# EAGLE design B12356-04 (EAGLE 6.6.0)
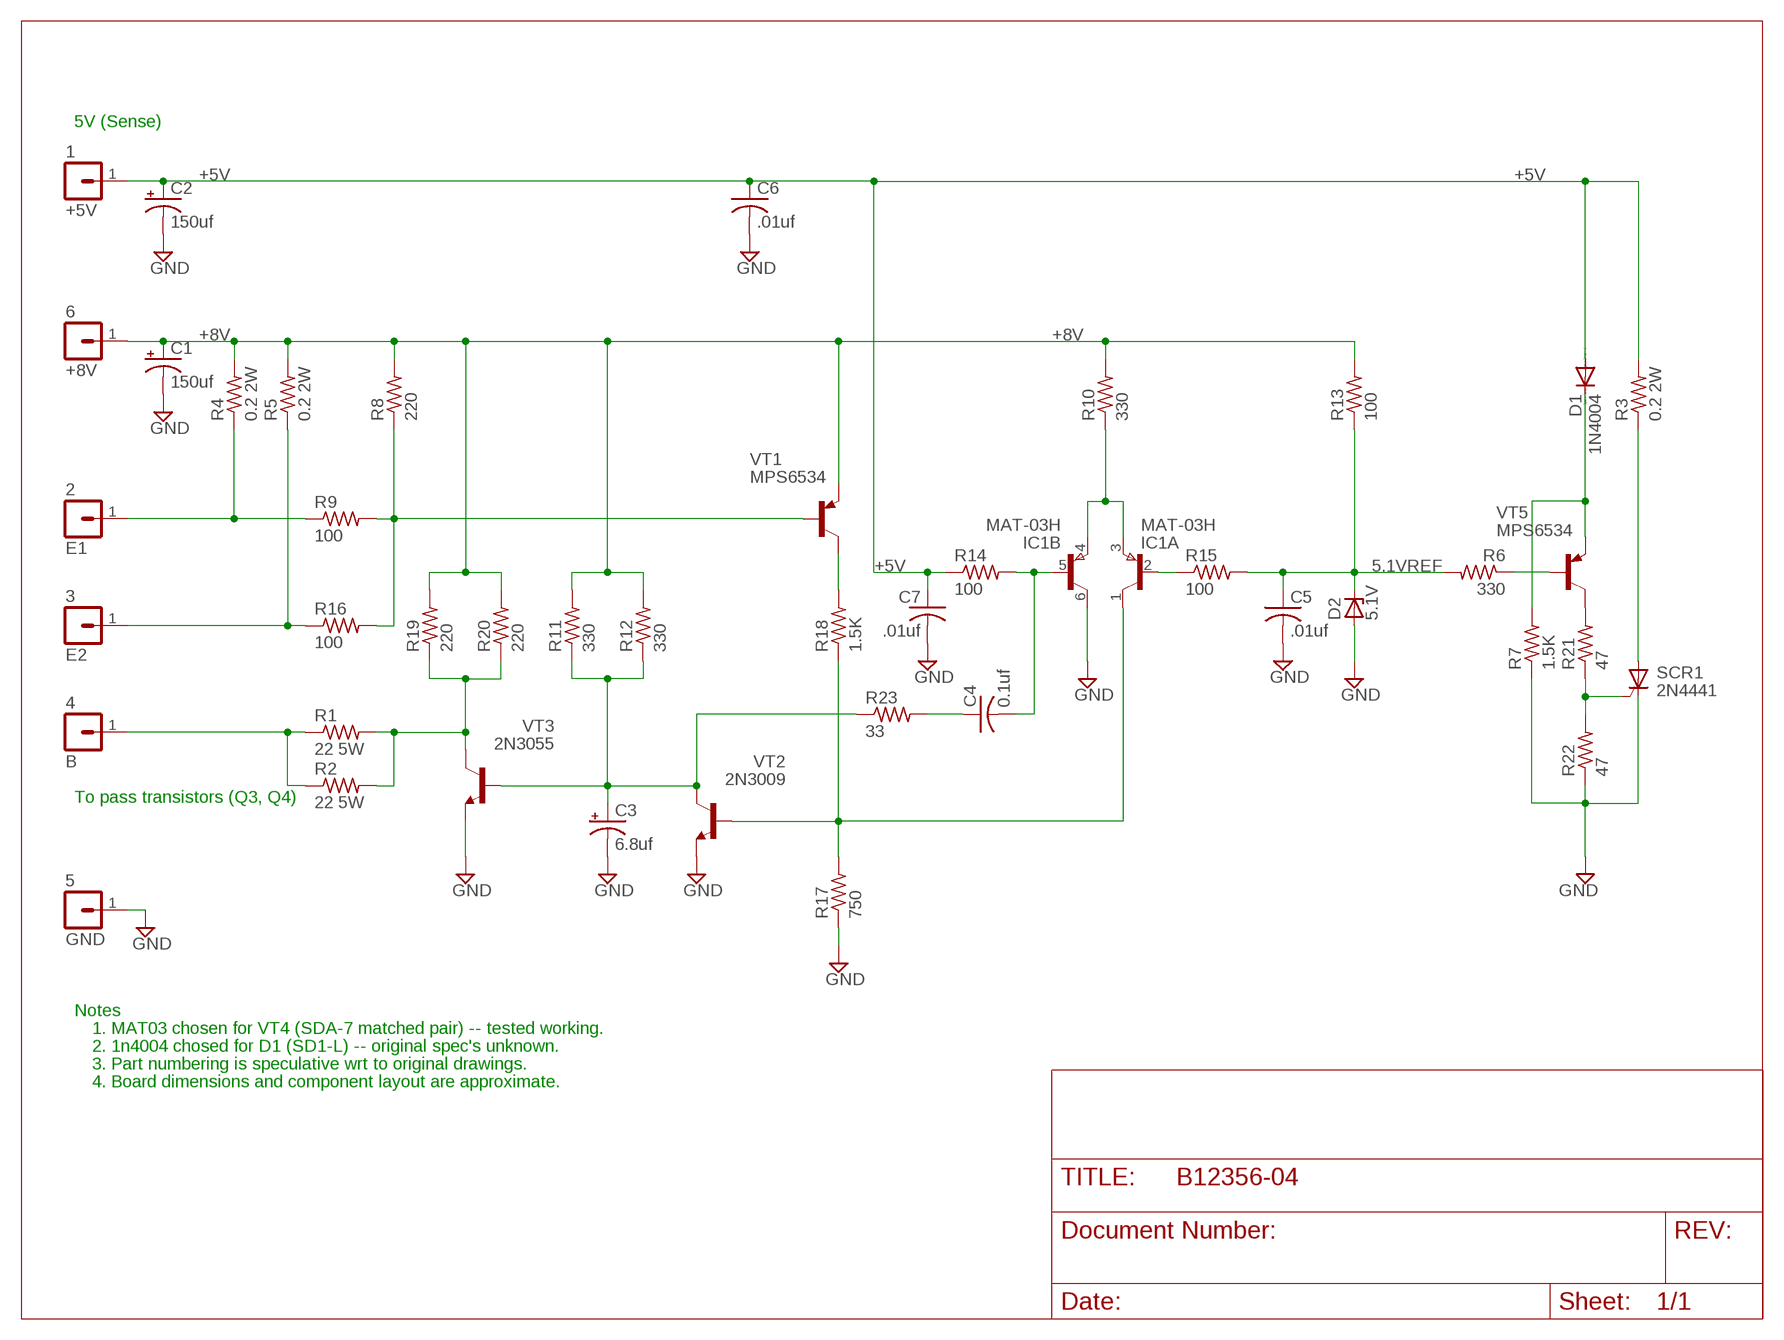
[diagram p0: schematic, sheet 1]

## Parts
+5V  1  LUG  [SPADELUG]
+8V  6  LUG  [SPADELUG]
B  4  LUG  [SPADELUG]
C1  150uf  CPOL-USE22-6AXIAL  [E22-6]
C2  150uf  CPOL-USE22-6AXIAL  [E22-6]
C3  6.8uf  CPOL-USE15-5AXIAL  [E15-5]
C4  0.1uf  C-US102-064X133  [C102-064X133]
C5  .01uf  C-US050-025X075  [C050-025X075]
C6  .01uf  C-US050-025X075  [C050-025X075]
C7  .01uf  C-US050-025X075  [C050-025X075]
D1  1N4004  [DO41-10]
D2  5.1V  ZENER-DIODEDO41Z10  [DO41Z10]
E1  2  LUG  [SPADELUG]
E2  3  LUG  [SPADELUG]
GND  5  LUG  [SPADELUG]
IC1  MAT-03H  [TO78]
R1  22 5W  R-US_0817/22  [P0817/22]
R2  22 5W  R-US_0817/22  [P0817/22]
R3  0.2 2W  R-US_0414/15  [0414/15]
R4  0.2 2W  R-US_0414/15  [0414/15]
R5  0.2 2W  R-US_0414/15  [0414/15]
R6  330  R-US_0207/10  [0207/10]
R7  1.5K  R-US_0207/10  [0207/10]
R8  220  R-US_0207/10  [0207/10]
R9  100  R-US_0207/10  [0207/10]
R10  330  R-US_0207/10  [0207/10]
R11  330  R-US_0207/10  [0207/10]
R12  330  R-US_0207/10  [0207/10]
R13  100  R-US_0207/10  [0207/10]
R14  100  R-US_0207/10  [0207/10]
R15  100  R-US_0207/10  [0207/10]
R16  100  R-US_0207/10  [0207/10]
R17  750  R-US_0207/10  [0207/10]
R18  1.5K  R-US_0207/10  [0207/10]
R19  220  R-US_0207/10  [0207/10]
R20  220  R-US_0207/10  [0207/10]
R21  47  R-US_0207/10  [0207/10]
R22  47  R-US_0207/10  [0207/10]
R23  33  R-US_0207/10  [0207/10]
SCR1  2N4441  BT151  [TO220CL]
VT1  MPS6534  MPSA56-PNP-TO92-BCE  [TO92-BCE]
VT2  2N3009  2N2222  [TO18]
VT3  2N3055  [TO3]
VT5  MPS6534  MPSA56-PNP-TO92-BCE  [TO92-BCE]

## Nets
5.1VREF: C5.1 D2.C R6.2 R13.1 R15.2
+5V: +5V.1 C2.+ C6.1 C7.1 D1.A R3.2 R14.1
+8V: +8V.1 C1.+ R4.2 R5.2 R8.2 R10.2 R11.2 R12.2 R13.2 R19.2 R20.2 VT1.E
GND: C1.- C2.- C3.- C5.2 C6.2 C7.2 D2.A GND.1 IC1.6(B:C) R7.1 R17.1 R22.1 SCR1.C VT2.1(E) VT3.E
N$1: IC1.2(A:B) R15.1
N$2: IC1.3(A:E) IC1.4(B:E) R10.1
N$3: R3.1 SCR1.A
N$4: R21.1 R22.2 SCR1.G
N$5: E1.1 R4.1 R9.1
N$6: E2.1 R5.1 R16.1
N$7: R8.1 R9.2 R16.2 VT1.B
N$8: R21.2 VT5.C
N$9: D1.C R7.2 VT5.E
N$10: R6.1 VT5.B
N$11: IC1.1(A:C) R17.2 R18.1 VT2.2(B)
N$12: B.1 R1.1 R2.1
N$13: R18.2 VT1.C
N$14: C3.+ R11.1 R12.1 R23.1 VT2.3(C) VT3.B
N$16: R1.2 R2.2 R19.1 R20.1 VT3.C VT3.C/(C)
N$18: C4.2 IC1.5(B:B) R14.2
N$19: C4.1 R23.2

## Notes on the sheet
- 5V (Sense)
- To pass transistors (Q3, Q4)
- Notes
- 1. MAT03 chosen for VT4 (SDA-7 matched pair) -- tested working.
- 2. 1n4004 chosed for D1 (SD1-L) -- original spec's unknown.
- 3. Part numbering is speculative wrt to original drawings.
- 4. Board dimensions and component layout are approximate.

## Library data of the parts
+5V +8V B E1 E2 GND = dec-con:LUG: Spade Lug
C1-C3 = rcl:CPOL-US: POLARIZED CAPACITOR, American symbol
C4-C7 = rcl:C-US: CAPACITOR, American symbol
D1 = diode:1N4004: DIODE general purpose rectifier, 1 A
D2 = diode:ZENER-DIODE: Z-Diode
IC1 = linear:MAT-03H: Dual TRANSISTOR
R1-R23 = rcl:R-US_: RESISTOR, American symbol
SCR1 = triac:BT151: THYRISTOR
VT1 VT5 = transistor:*-PNP-: PNP Transistror
VT2 = transistor:2N2222: NPN TRANSISTOR
VT3 = transistor-npn:2N3055: NPN Transistor

## Board
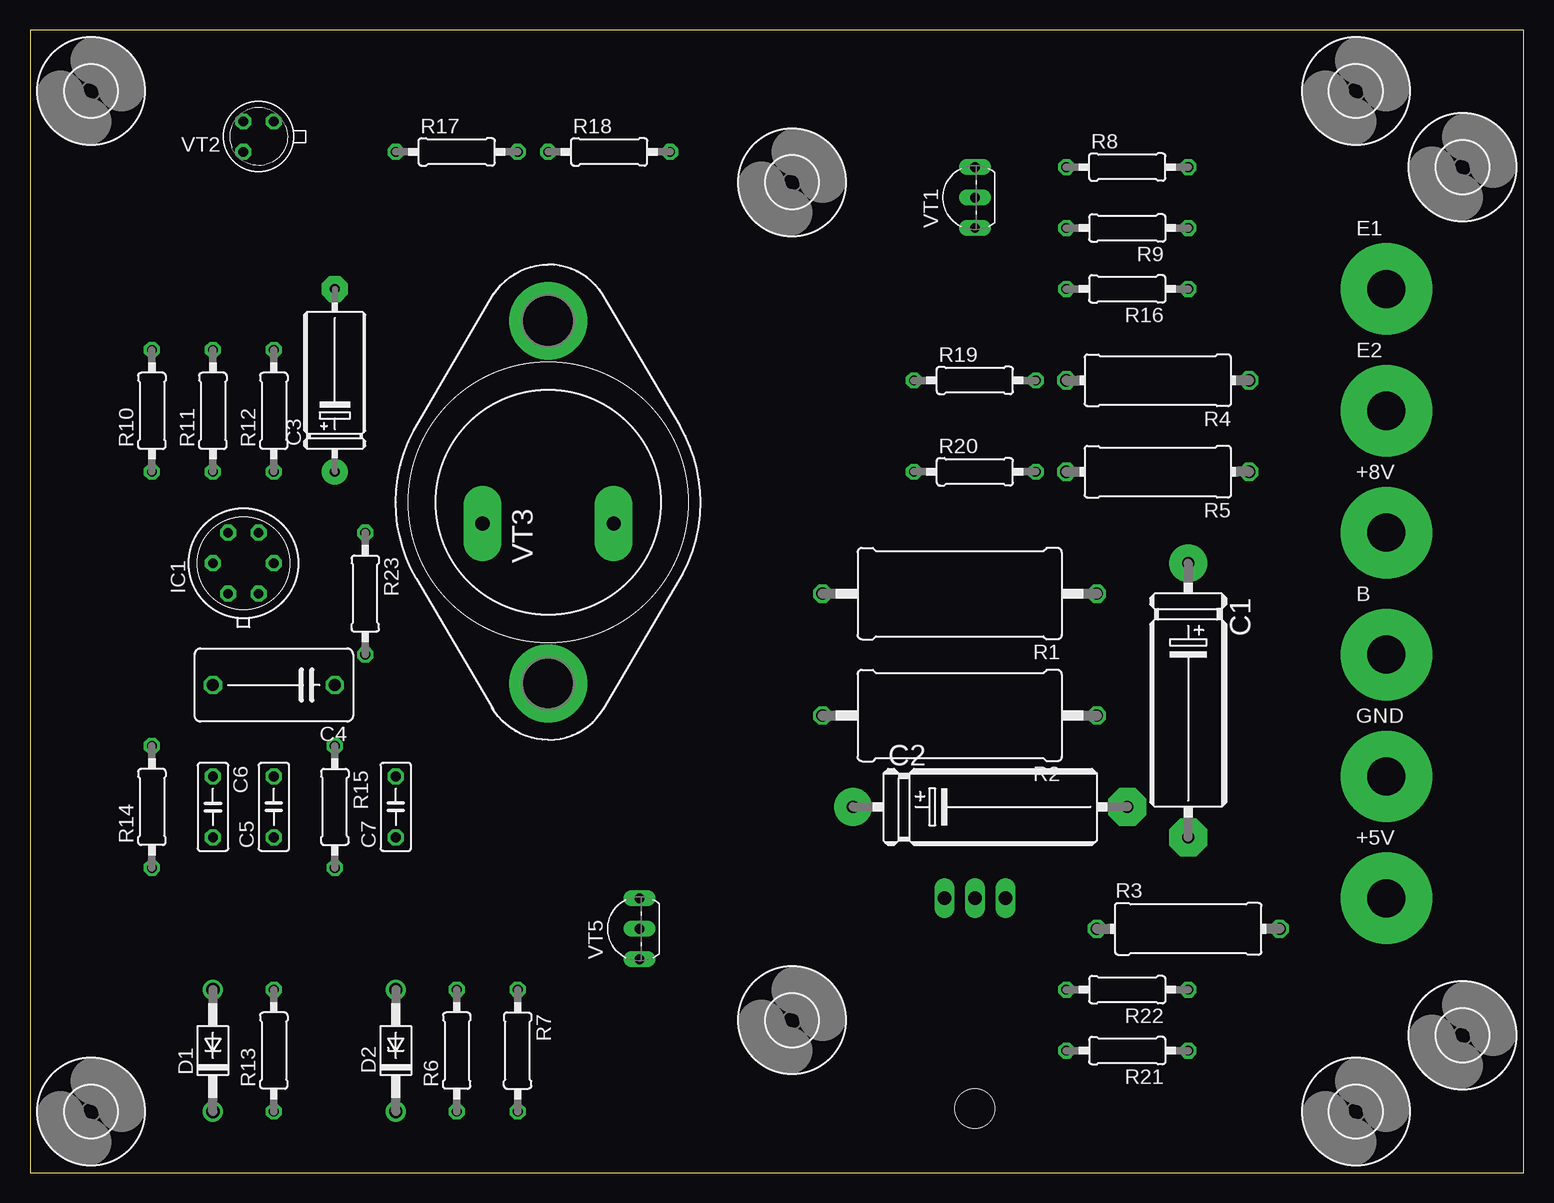
[diagram p1: board, top side]
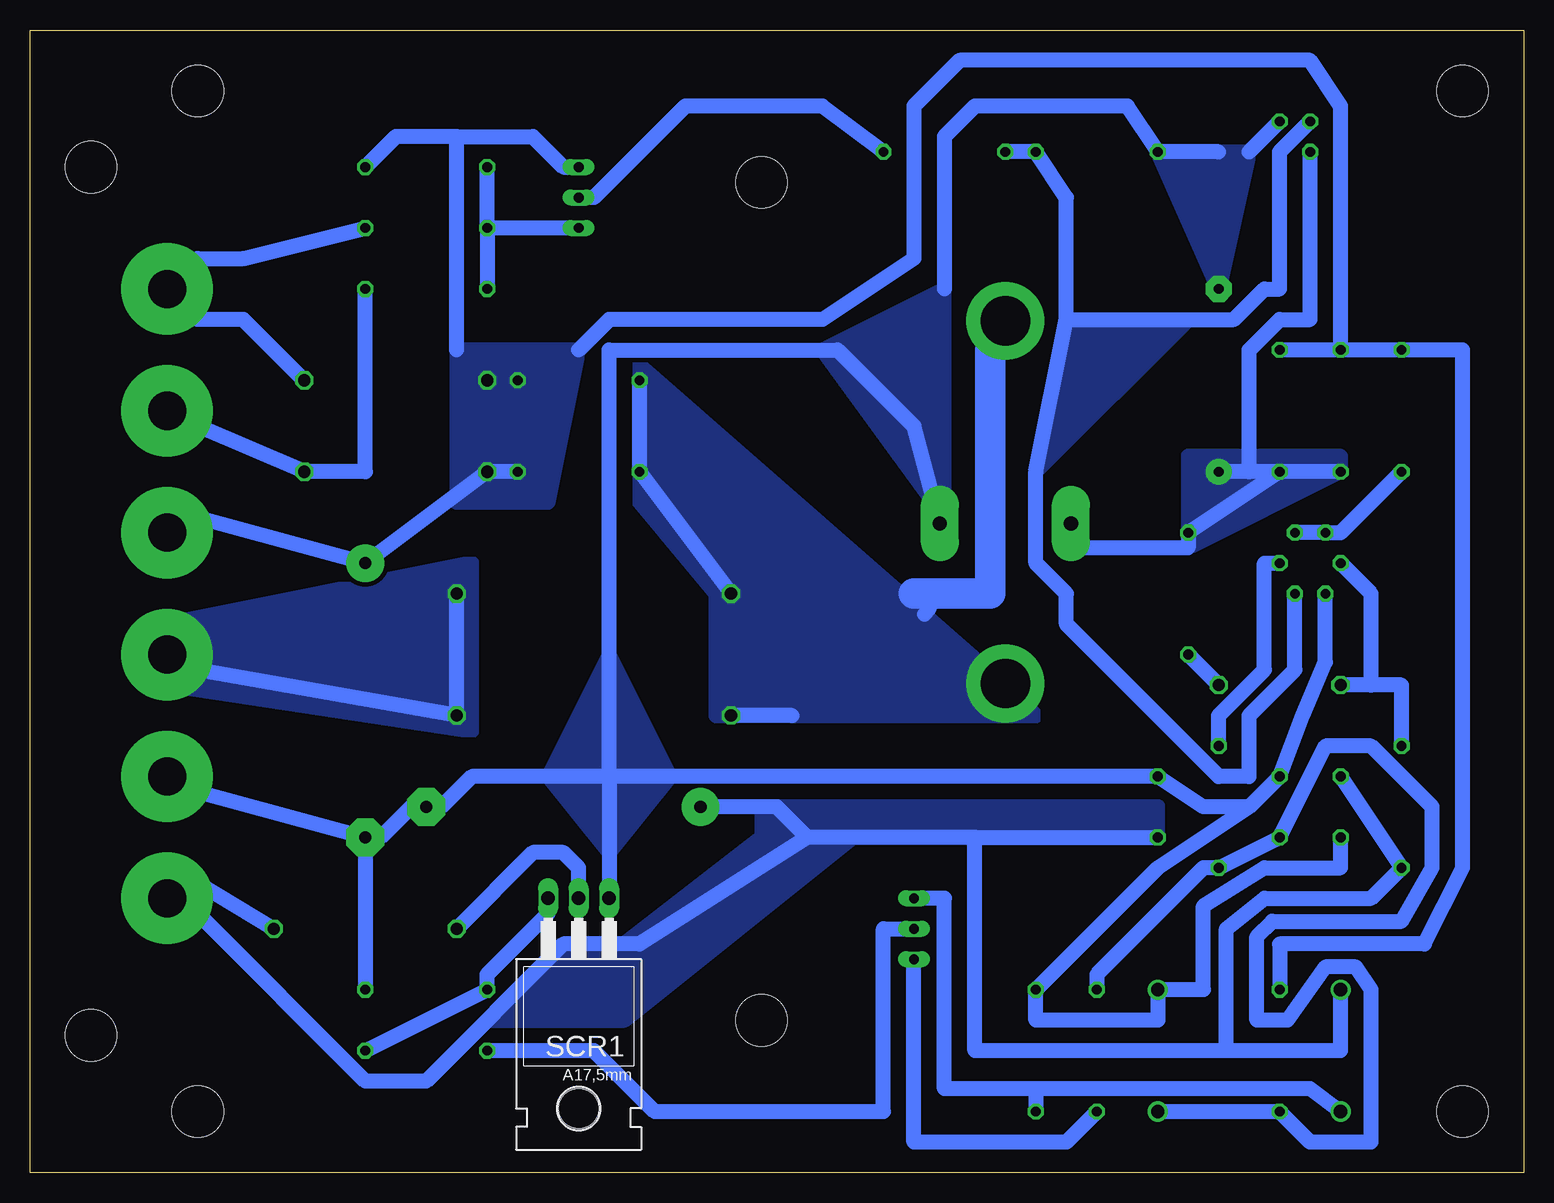
[diagram p2: board, bottom side, seen from below]

Size 124.46 x 95.25 mm. Coordinates in mm from the lower left corner, seen from the top.
Outline: 0,0 124.46,0 124.46,95.25 0,95.25 0,0
Copper layers (1+16): Top 0.035mm / dielectric 1.5mm / Bottom 0.035mm
Design rules "16mils": minimum track width 16mil, minimum drill 32mil, track to track 15mil, track to pad 10mil, pad to pad 10mil, via to via 10mil, smd to smd 10mil, copper to edge 13mil, drill to drill 10mil, minimum pad ring 10mil, minimum via ring 8mil, stop-mask expansion 0mil, vias tented up to drill 0mil, thermal gap 10mil

### Footprints (pad centres in the part's own frame; a part is rotated, then mirrored left to right if it is on the bottom)
SPADELUG = drill 3.175 pad 7.62: 1 0,0
E22-6 = drill 1.016 pad 3.15: + -11.43,0 | drill 1.016 pad 3.15 octagon: - 11.43,0
E15-5 = drill 0.813 pad 2.159: + -7.62,0 | drill 0.813 pad 2.159 octagon: - 7.62,0
C102-064X133 = drill 1.016 octagon: 1 -5.08,0; 2 5.08,0
C050-025X075 = drill 0.813 octagon: 1 -2.54,0; 2 2.54,0
DO41-10 = drill 1.118: A 5.08,0; C -5.08,0
DO41Z10 = drill 1.118: A 5.08,0; C -5.08,0
TO78 = drill 0.813 octagon: 1 -2.54,-1.27; 2 0,-2.54; 3 2.54,-1.27; 4 2.54,1.27; 5 0,2.54; 6 -2.54,1.27
P0817/22 = drill 1.016 octagon: 1 -11.43,0; 2 11.43,0
0414/15 = drill 1.016 octagon: 1 -7.62,0; 2 7.62,0
0207/10 = drill 0.813 octagon: 1 -5.08,0; 2 5.08,0
TO220CL = drill 1.118 long: A 0,-6.35; C -2.54,-6.35; G 2.54,-6.35 | hole 3.302: 0,11.176
4,3 = hole 4.3: 0,0
TO92-BCE = drill 0.813 long: B -2.54,0; C 0,0; E 2.54,0
TO18 = drill 0.813 octagon: 1 -1.27,-1.27; 2 1.27,-1.27; 3 1.27,1.27
TO3 = drill 1.194 pad 3.15 long: B -1.778,5.461; E -1.778,-5.461 | drill 4.115 pad 6.477: C 15.113,0; C/ -15.113,0

### Placement (x,y rotation side)
+5V  113.03,22.86 0 top
+8V  113.03,53.34 0 top
B  113.03,43.18 0 top
C1  96.52,39.37 270 top
C2  80.01,30.48 0 top
C3  25.4,66.04 90 top
C4  20.32,40.64 180 top
C5  20.32,30.48 90 top
C6  15.24,30.48 270 top
C7  30.48,30.48 90 top
D1  15.24,10.16 90 top
D2  30.48,10.16 90 top
E1  113.03,73.66 0 top
E2  113.03,63.5 0 top
GND  113.03,33.02 0 top
IC1  17.78,50.8 90 top
R1  77.47,48.26 180 top
R2  77.47,38.1 180 top
R3  96.52,20.32 0 top
R4  93.98,66.04 180 top
R5  93.98,58.42 180 top
R6  35.56,10.16 90 top
R7  40.64,10.16 270 top
R8  91.44,83.82 0 top
R9  91.44,78.74 180 top
R10  10.16,63.5 90 top
R11  15.24,63.5 90 top
R12  20.32,63.5 90 top
R13  20.32,10.16 90 top
R14  10.16,30.48 90 top
R15  25.4,30.48 270 top
R16  91.44,73.66 180 top
R17  35.56,85.09 0 top
R18  48.26,85.09 0 top
R19  78.74,66.04 0 top
R20  78.74,58.42 0 top
R21  91.44,10.16 180 top
R22  91.44,15.24 180 top
R23  27.94,48.26 270 top
SCR1  78.74,16.51 180 bottom
U$1  [4,3]  5.08,90.17 0 top
U$2  [4,3]  5.08,5.08 0 top
U$3  [4,3]  63.5,82.55 0 top
U$4  [4,3]  119.38,83.82 0 top
U$5  [4,3]  110.49,90.17 0 top
U$6  [4,3]  110.49,5.08 0 top
U$7  [4,3]  119.38,11.43 0 top
U$8  [4,3]  63.5,12.7 0 top
VT1  78.74,81.28 90 top
VT2  19.05,86.36 180 top
VT3  43.18,55.88 90 top
VT5  50.8,20.32 90 top

### Tracks (layer width: path | path; a pad name or v marks a point on that pad's centre or on a via)
5.1VREF
  Bottom 1.27: D2.C R13.1 17.78,2.54 12.7,2.54 12.7,15.24 13.97,17.14 16.51,17.14 19.68,12.7 22.23,12.7 22.23,19.68 20.95,20.95 10.16,20.95 7.62,25.4 7.62,30.48 12.7,35.56 16.51,35.56 C5.1 R15.2 26.67,25.4 35.56,16.51 R6.2
+5V
  Bottom 1.27: R3.2 110.49,24.13 +5V.1 110.49,21.59 96.52,7.62 91.44,7.62 80.01,19.05 73.66,19.05 59.69,27.94 | 59.69,27.94 62.23,30.48 C2.+ | 45.72,27.94 59.69,27.94 | D1.A 15.24,10.16 24.77,10.16 | 24.77,10.16 45.72,10.16 45.72,27.94 | C6.1 R14.1 12.7,22.86 21.59,22.86 24.77,20.32 24.77,10.16 | 45.72,27.94 C7.1
  pour Bottom (no thermals): 30.48,27.94 30.48,30.48 63.5,30.48 63.5,27.94
  pour Bottom (no thermals): 86.36,12.7 74.93,12.7 55.88,27.94 63.5,27.94 74.93,19.05 80.01,19.05
+8V
  Bottom 1.27: R20.2 R5.2 C1.+ 110.49,54.61 +8V.1 | 88.9,86.36 82.55,86.36 80.01,83.82 VT1.E | 88.9,86.36 93.98,86.36 R8.2 | R11.2 R12.2 | 88.9,68.58 88.9,86.36 | 78.74,68.58 76.2,71.12 58.42,71.12 50.8,76.2 50.8,88.9 46.99,92.71 17.78,92.71 15.24,88.9 R11.2 | R11.2 R10.2 5.08,68.58 5.08,25.4 8.26,19.05 20.32,19.05 R13.2
  pour Bottom (no thermals): 78.74,68.58 88.9,68.58 88.9,55.88 81.28,55.88
GND
  Bottom 1.27: C1.- 95.25,27.94 92.71,30.48 C2.- 90.17,30.48 87.63,33.02 76.2,33.02 | C1.- 110.49,31.75 GND.1 | 25.4,85.09 R17.1 33.02,88.9 45.72,88.9 48.26,86.36 48.26,73.66 | 76.2,33.02 76.2,68.58 57.15,68.58 50.8,62.23 VT3.E | 76.2,33.02 C7.2 26.67,30.48 22.86,30.48 | C1.- R22.1 | 76.2,33.02 SCR1.C | 22.86,30.48 30.48,25.4 R7.1 40.64,12.7 30.48,12.7 D2.A 26.67,15.24 26.67,22.23 21.59,25.4 15.24,25.4 C6.2 | 22.86,30.48 C5.2 18.41,38.1 16.51,42.55 IC1.6 | VT2.1 22.86,85.09
  pour Bottom (no thermals): 48.26,54.61 48.26,73.66 58.42,68.58
  pour Bottom (no thermals): 22.86,85.09 25.4,73.66 30.48,85.09
  pour Bottom (no thermals): 76.2,43.18 71.12,33.02 76.2,26.67 81.28,33.02
N$1
  Bottom 1.27: R15.1 25.4,38.1 21.59,41.91 21.59,50.8 IC1.2
N$2
  Bottom 1.27: IC1.3 IC1.4 15.24,53.34 R10.1
N$3
  Bottom 1.27: R3.1 82.55,26.67 80.01,26.67 78.74,25.4 SCR1.A
N$4
  Bottom 1.27: R21.1 R22.2 86.36,16.51 81.28,21.59 SCR1.G
N$5
  Bottom 1.27: R9.1 106.68,76.2 110.49,76.2 E1.1 110.49,71.12 106.68,71.12 R4.1
N$6
  Bottom 1.27: E2.1 110.49,62.23 R5.1 96.52,58.42 R16.1
N$7
  Bottom 1.27: VT1.B R9.2 | R9.2 R8.1 | R9.2 R16.2
N$8
  Bottom 1.27: R21.2 77.47,10.16 72.39,5.08 53.34,5.08 53.34,20.32 VT5.C
N$9
  Bottom 1.27: 40.64,6.99 R7.2 | 40.64,6.99 48.26,6.99 48.26,22.86 VT5.E | D1.C 17.78,6.99 40.64,6.99
N$10
  Bottom 1.27: R6.1 38.1,2.54 50.8,2.54 VT5.B
N$11
  Bottom 1.27: R18.1 R17.2 38.1,81.28 38.1,71.12 | 38.1,71.12 40.64,58.42 40.64,50.8 38.1,48.26 38.1,45.72 25.4,33.02 22.86,33.02 22.86,38.1 19.05,41.91 IC1.1 | VT2.2 20.32,85.09 20.32,73.66 21.59,73.66 24.13,71.12 38.1,71.12
  pour Bottom (no thermals): 27.94,71.12 40.64,58.42 38.1,71.12
N$12
  Bottom 1.27: R1.1 R2.1 110.49,41.91 B.1
  pour Bottom (no thermals): 87.63,36.83 87.63,50.8 113.03,45.72 113.03,40.64
N$13
  Bottom 1.27: R18.2 58.42,88.9 69.85,88.9 77.47,81.28 VT1.C
N$14
  Bottom 1.27: R11.1 R12.1 | R12.1 22.86,58.42 | 22.86,58.42 C3.+ | VT2.3 17.78,71.12 20.32,71.12 22.86,68.58 22.86,58.42 | VT3.B 36.83,52.07 27.94,52.07 R23.1 R12.1
  pour Bottom (no thermals): 27.94,52.07 15.24,58.42 15.24,59.69 27.94,59.69
N$16
  Bottom 1.27: R19.1 R20.1 R1.2 | 60.96,38.1 R2.2 | 49.53,48.26 49.53,46.99 49.92,46.54
  Bottom 2.54: 50.8,48.26 49.53,48.26 44.45,48.26 44.45,68.58 VT3.C
  pour Bottom (no thermals): 43.18,40.64 73.66,67.31 73.66,55.88 67.31,48.26 67.31,38.1 40.64,38.1
N$18
  Bottom 1.27: R14.2 10.16,40.64 12.7,40.64 | 12.7,40.64 C4.2 | IC1.5 12.7,48.26 12.7,40.64
N$19
  Bottom 1.27: C4.1 R23.2